# EAGLE board legacy mk1 with acc_16meg_crystal and TPs (EAGLE 9.5.2)
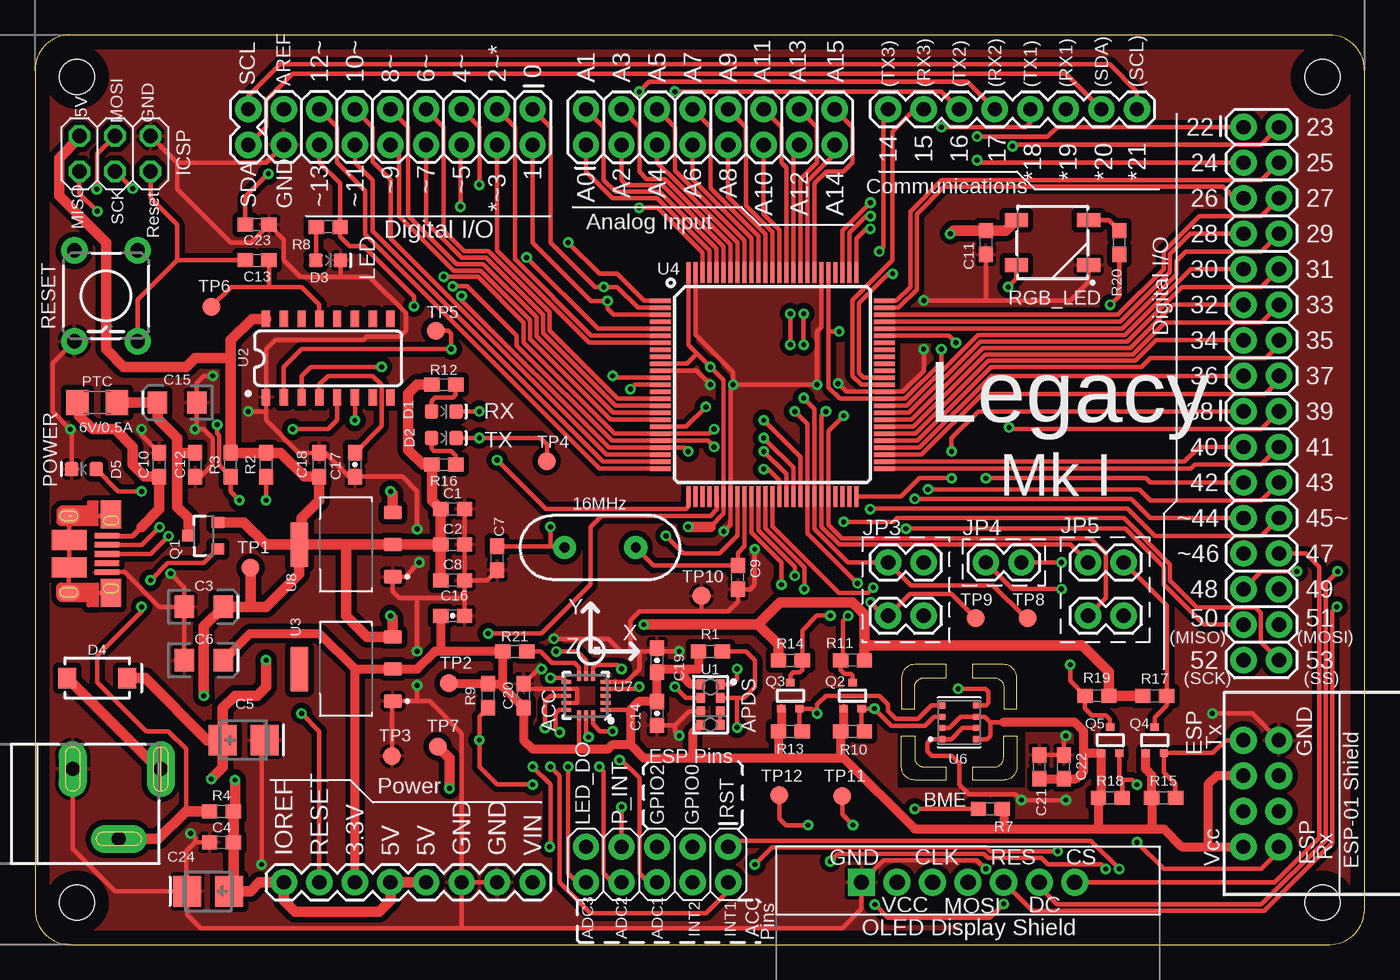
[diagram p2: board, top side]
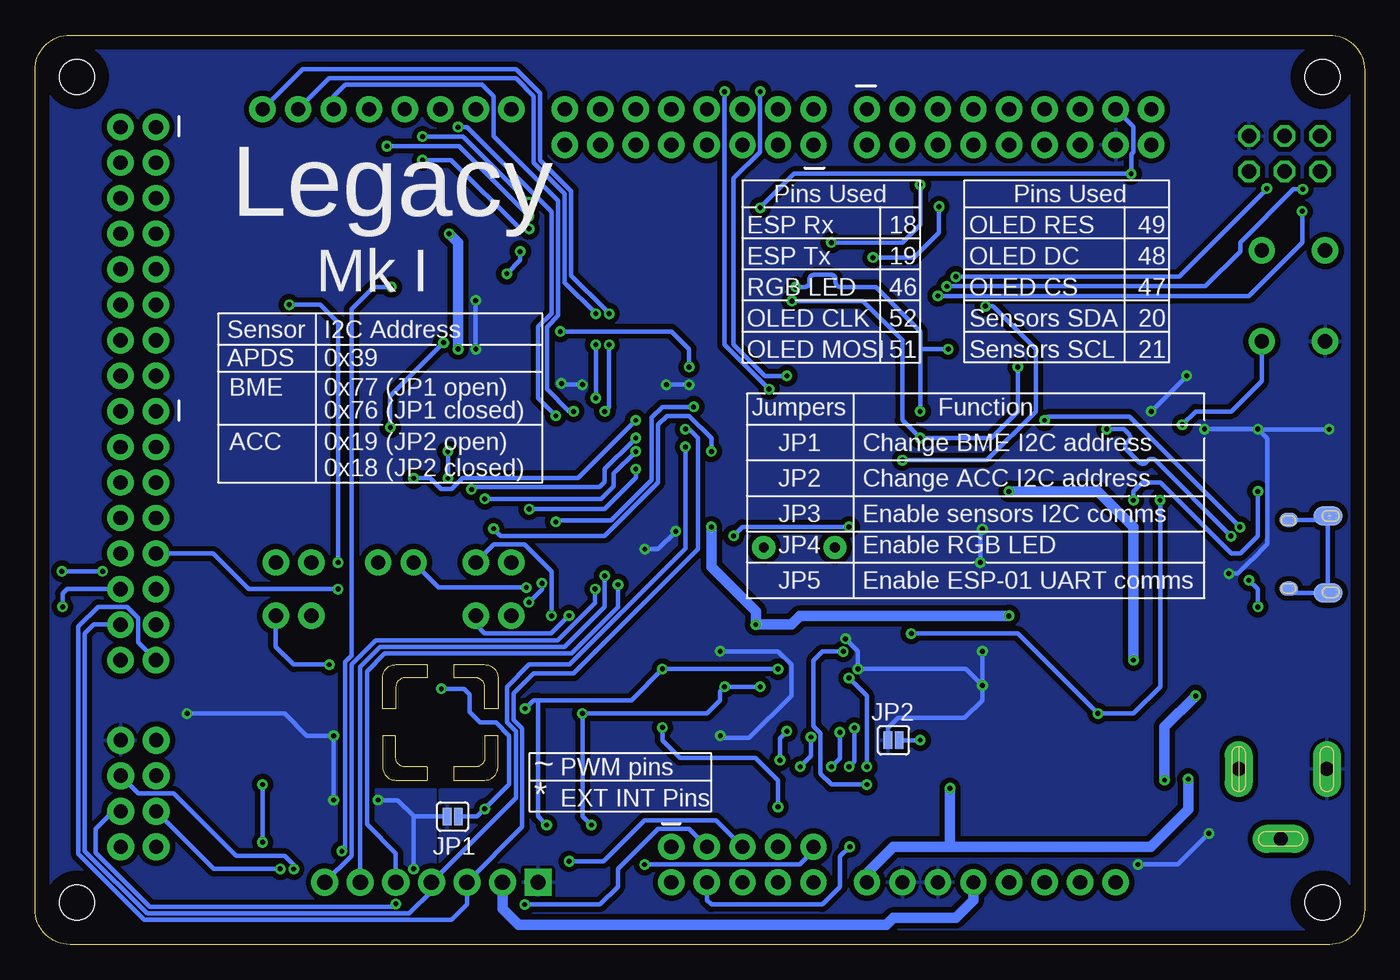
[diagram p3: board, bottom side, seen from below]

Size 95 x 65 mm. Coordinates in mm from the lower left corner, seen from the top.
Outline: 0,62.5 0,2.5 arc90 2.5,0 92.5,0 arc90 95,2.5 95,62.5 arc90 92.5,65 2.5,65 arc90 0,62.5
Copper layers (1*16): Top 0.035mm / dielectric 1.5mm / Bottom 0.035mm
Design rules "default": minimum track width 6mil, minimum drill 0.35mm, track to track 6mil, track to pad 6mil, pad to pad 6mil, via to via 6mil, smd to smd 6mil, copper to edge 40mil, drill to drill 6mil, minimum pad ring 10mil, minimum via ring 8mil, stop-mask expansion 4mil, vias tented up to drill 0mil, thermal gap 10mil
Holes 2.5 mm at 3,3 3,62 92,62 92,3
Milling: 32 lines

## Footprints (pad centres in the part's own frame; a part is rotated, then mirrored left to right if it is on the bottom)
0603 = smd 1.1 x 1: 1 -0.85,0; 2 0.85,0
EIA3216 = smd 1.4 x 1.6: + 1.4,0; - -1.4,0
CT3528 = smd 2 x 2.2: + -1.5,0; - 1.5,0
0603-CAP = smd 1.1 x 1: 1 -0.85,0; 2 0.85,0
LED-0603 = smd 1 x 1: A -0.877,0; C 0.877,0
SMA-DIODE = smd 1.27 x 1.47: A -2.15,0; C 2.15,0
USB-MICROB-PTH-MILL = smd 0.4 x 1.75: D+ 0.031,1.331; D- -0.619,1.331; GND 1.331,1.331; ID 0.681,1.331; VBUS -1.269,1.331 | smd 2 x 1.46: SHIELD -2.794,1.606; SHIELD2 2.831,1.606 | smd 1.425 x 2.5: SHIELD3 -0.979,-1.349; SHIELD4 0.996,-1.352 | smd 1.4 x 2.1 bottom: SHIELD5 -2.7,-1.2; SHIELD7 2.8,-1.2 | smd 1.1 x 1.5: SHIELD6 2.8,-1.4; SHIELD8 -2.7,-1.4 | smd 1 x 1.3 bottom: SHIELD9 -2.4,1.6; SHIELD10 2.5,1.6
2X03 = drill 1.016 octagon: 1 -2.54,-1.27; 2 -2.54,1.27; 3 0,-1.27; 4 0,1.27; 5 2.54,-1.27; 6 2.54,1.27
POWER_JACK_SLOT = drill 1 pad 2 long: GND@1 2.58,7.5; GND@2 7.58,10.8; PWR 2.58,13.8
1X08 = drill 1.016 pad 1.88: 1 0,0; 2 2.54,0; 3 5.08,0; 4 7.62,0; 5 10.16,0; 6 12.7,0; 7 15.24,0; 8 17.78,0
2X8 = drill 1.016 pad 1.88: 1 0,0; 2 0,2.54; 3 2.54,0; 4 2.54,2.54; 5 5.08,0; 6 5.08,2.54; 7 7.62,0; 8 7.62,2.54; 9 10.16,0; 10 10.16,2.54; 11 12.7,0; 12 12.7,2.54; 13 15.24,0; 14 15.24,2.54; 15 17.78,0; 16 17.78,2.54
1X02 = drill 1.016 pad 1.88: 1 0,0; 2 2.54,0
2X5 = drill 1.016 pad 1.88: 1 0,0; 2 0,2.54; 3 2.54,0; 4 2.54,2.54; 5 5.08,0; 6 5.08,2.54; 7 7.62,0; 8 7.62,2.54; 9 10.16,0; 10 10.16,2.54
SMT-JUMPER_2_NO_SILK = smd 0.635 x 1.27: 1 -0.406,0; 2 0.406,0
OLED_SHIELD = drill 1.1 pad 1.93: CS 7.62,0; D0/CLK -2.54,0; D1/MOSI 0,0; DC 5.08,0; RES 2.54,0; VCC -5.08,0 | drill 1.1 pad 1.93 square: GROUND -7.62,0
1206 = smd 1.6 x 1.8: 1 -1.4,0; 2 1.4,0
SOT23-3 = smd 0.8 x 0.9: 1 -0.95,-1; 2 0.95,-1; 3 0,1.1
SOT323-R = smd 0.6 x 0.55: 1 -0.65,-0.925; 2 0.65,-0.925; 3 0,0.925
TACTILE_SWITCH_PTH_6.0MM = drill 1.016 pad 1.88: 1 -3.251,2.261; 2 3.251,2.261; 3 -3.251,-2.261; 4 3.251,-2.261
WS2812B = smd 1.651 x 1: 1 2.577,-1.6; 2 2.577,1.6; 3 -2.577,1.6; 4 -2.577,-1.6
B1,27 = smd 1.27 x 1.27: TP 0,0
APDS-9960 = smd 0.6 x 0.72: 1 0.7,1.455; 2 0.7,0.485; 3 0.7,-0.485; 4 0.7,-1.455; 5 -0.7,-1.455; 6 -0.7,-0.485; 7 -0.7,0.485; 8 -0.7,1.455
SO016 = smd 0.6 x 1.2: 1 -4.445,-2.8; 2 -3.175,-2.8; 3 -1.905,-2.8; 4 -0.635,-2.8; 5 0.635,-2.8; 6 1.905,-2.8; 7 3.175,-2.8; 8 4.445,-2.8; 9 4.445,2.8; 10 3.175,2.8; 11 1.905,2.8; 12 0.635,2.8; 13 -0.635,2.8; 14 -1.905,2.8; 15 -3.175,2.8; 16 -4.445,2.8
SOT229P700X180-4N = smd 0.93 x 1.31: 1 -2.29,-3.345; 2 0,-3.345; 3 2.29,-3.345 | smd 3.24 x 1.31: 4 0,3.345
TQFP100 = smd 1.5 x 0.3: 1 -8,6; 2 -8,5.5; 3 -8,5; 4 -8,4.5; 5 -8,4; 6 -8,3.5; 7 -8,3; 8 -8,2.5; 9 -8,2; 10 -8,1.5; 11 -8,1; 12 -8,0.5; 13 -8,0; 14 -8,-0.5; 15 -8,-1; 16 -8,-1.5; 17 -8,-2; 18 -8,-2.5; 19 -8,-3; 20 -8,-3.5; 21 -8,-4; 22 -8,-4.5; 23 -8,-5; 24 -8,-5.5; 25 -8,-6; 51 8,-6; 52 8,-5.5; 53 8,-5; 54 8,-4.5; 55 8,-4; 56 8,-3.5; 57 8,-3; 58 8,-2.5; 59 8,-2; 60 8,-1.5; 61 8,-1; 62 8,-0.5; 63 8,0; 64 8,0.5; 65 8,1; 66 8,1.5; 67 8,2; 68 8,2.5; 69 8,3; 70 8,3.5; 71 8,4; 72 8,4.5; 73 8,5; 74 8,5.5; 75 8,6 | smd 0.3 x 1.5: 26 -6,-8; 27 -5.5,-8; 28 -5,-8; 29 -4.5,-8; 30 -4,-8; 31 -3.5,-8; 32 -3,-8; 33 -2.5,-8; 34 -2,-8; 35 -1.5,-8; 36 -1,-8; 37 -0.5,-8; 38 0,-8; 39 0.5,-8; 40 1,-8; 41 1.5,-8; 42 2,-8; 43 2.5,-8; 44 3,-8; 45 3.5,-8; 46 4,-8; 47 4.5,-8; 48 5,-8; 49 5.5,-8; 50 6,-8; 76 6,8; 77 5.5,8; 78 5,8; 79 4.5,8; 80 4,8; 81 3.5,8; 82 3,8; 83 2.5,8; 84 2,8; 85 1.5,8; 86 1,8; 87 0.5,8; 88 0,8; 89 -0.5,8; 90 -1,8; 91 -1.5,8; 92 -2,8; 93 -2.5,8; 94 -3,8; 95 -3.5,8; 96 -4,8; 97 -4.5,8; 98 -5,8; 99 -5.5,8; 100 -6,8
ESP8266_ESP-01 = drill 1.016 pad 1.93: 1 -3.81,-11.13; 2 -1.27,-11.13; 3 1.27,-11.13; 4 3.81,-11.13; 5 3.81,-8.59; 6 1.27,-8.59; 7 -1.27,-8.59; 8 -3.81,-8.59
PSON80P300X300X100-8N = smd 0.5 x 0.5: 1 1.2,1.2; 2 1.2,0.4; 3 1.2,-0.4; 4 1.2,-1.2; 5 -1.2,-1.22; 6 -1.2,-0.4; 7 -1.2,0.4; 8 -1.2,1.2
LGA-16-3X3 = smd 0.7 x 0.28: 1 -1.4,1; 2 -1.4,0.5; 3 -1.4,0; 4 -1.4,-0.5; 5 -1.4,-1; 9 1.4,-1; 10 1.4,-0.5; 11 1.4,0; 12 1.4,0.5; 13 1.4,1 | smd 0.28 x 0.7: 6 -0.5,-1.4; 7 0,-1.4; 8 0.5,-1.4; 14 0.5,1.4; 15 0,1.4; 16 -0.5,1.4
HC49US = drill 0.7 pad 1.651: 1 -2.54,0; 2 2.54,0

## Placement (x,y rotation side)
C1  0.1uF  [0603]  29.84,31.11 0 top
C2  0.1uF  [0603]  29.84,28.57 0 top
C3  10uF  [EIA3216]  12.06,24.13 0 top
C4  0.1uF  [0603]  13.34,7.3 180 top
C5  22uF  [CT3528]  14.92,14.61 0 top
C6  10uF  [EIA3216]  12.06,20.32 0 top
C7  22pF  [0603]  33.02,27.61 90 top
C8  0.1uF  [0603]  29.84,26.04 0 top
C9  22pF  [0603]  50.22,26.24 90 top
C10  0.1uF  [0603]  8.89,34.29 90 top
C11  0.1uF  [0603]  67.94,50.16 270 top
C12  0.1uF  [0603]  11.43,34.29 270 top
C13  0.1uF  [0603]  15.88,48.9 180 top
C14  1.0uF  [0603-CAP]  44.45,16.51 270 top
C15  10uF  [EIA3216]  10.16,38.73 180 top
C16  1.0uF  [0603-CAP]  29.84,23.5 0 top
C17  10nF  [0603-CAP]  22.86,34.29 270 top
C18  0.1uF  [0603]  20.32,34.29 90 top
C19  1.0uF  [0603-CAP]  44.45,20.32 90 top
C20  0.1uF  [0603]  34.92,17.78 90 top
C21  0.1uF  [0603]  71.75,12.7 90 top
C22  0.1uF  [0603]  73.5,12.7 90 top
C23  0.1uF  [0603]  15.88,51.44 0 top
C24  22uF  [CT3528]  12.38,3.81 180 top
D1  Yellow  [LED-0603]  29.21,38.1 0 top
D2  GREEN  [LED-0603]  29.21,36.2 0 top
D3  BLUE  [LED-0603]  20.95,48.9 0 top
D4  1A/40V/500mV  [SMA-DIODE]  4.45,19.05 0 top
D5  GREEN  [LED-0603]  3.49,33.97 180 top
J1  AMP FCI 10103594-0001LF  [USB-MICROB-PTH-MILL]  3.81,27.94 270 top
J2  ICSP  [2X03]  5.71,56.52 0 top
J3  POWER_JACKSLT  [POWER_JACK_SLOT]  -4.81,15.12 270 top
J4  [1X08]  78.74,59.69 180 top
J5  [2X8]  86.36,58.42 270 top
J6  [2X8]  39.37,57.15 0 top
J7  [2X8]  86.36,38.1 270 top
J8  [1X02]  63.5,27.3 180 top
J9  [1X02]  63.5,23.5 180 top
J10  [1X08]  17.78,4.45 0 top
J11  [1X02]  77.79,27.3 180 top
J12  [1X02]  77.79,23.5 180 top
J13  [1X02]  67.94,27.3 0 top
J14  [2X5]  49.53,6.99 180 top
J15  [2X8]  35.56,59.69 180 top
J16  [1X02]  15.24,57.15 90 top
JP1  JUMPER-SMT_2_NO_SILK  [SMT-JUMPER_2_NO_SILK]  65.15,9.15 0 bottom
JP2  JUMPER-SMT_2_NO_SILK  [SMT-JUMPER_2_NO_SILK]  33.66,14.61 0 bottom
OLED  OLED_SHIELD  [OLED_SHIELD]  66.67,4.45 0 top
PTC  6V/0.5A  [1206]  4.45,38.73 0 top
Q1  1A/60V/500mΩ  [SOT23-3]  12.06,29.21 90 top
Q2  BSS138W  [SOT323-R]  58.42,17.78 0 top
Q3  BSS138W  [SOT323-R]  53.98,17.78 0 top
Q4  BSS138W  [SOT323-R]  80.01,14.61 0 top
Q5  BSS138W  [SOT323-R]  76.83,14.61 0 top
R1  10k  [0603]  48.26,20.95 180 top
R2  10k  [0603]  16.51,34.29 90 top
R3  10k  [0603]  13.97,34.29 90 top
R4  10k  [0603]  13.34,9.53 0 top
R7  4.7k  [0603]  68.26,9.68 0 top
R8  4.7k  [0603]  20.95,51.28 0 top
R9  10k  [0603]  32.38,17.78 90 top
R10  4.7k  [0603]  58.42,15.24 180 top
R11  4.7k  [0603]  58.42,20.32 0 top
R12  4.7k  [0603]  29.21,40.01 180 top
R13  4.7k  [0603]  53.98,15.24 180 top
R14  4.7k  [0603]  53.98,20.32 180 top
R15  4.7k  [0603]  80.64,10.48 180 top
R16  4.7k  [0603]  29.21,34.29 180 top
R17  4.7k  [0603]  80.01,17.78 180 top
R18  4.7k  [0603]  76.83,10.48 180 top
R19  4.7k  [0603]  75.88,17.78 0 top
R20  220  [0603]  77.47,50.16 90 top
R21  10k  [0603]  34.29,20.95 180 top
RESET  MOMENTARY-SWITCH-SPST-PTH-6.0MM  [TACTILE_SWITCH_PTH_6.0MM]  5.08,46.35 90 top
RGB_LED  WS2812B  [WS2812B]  72.71,50.16 180 top
TP1  PTR1B1,27  [B1,27]  15.4,26.91 0 top
TP2  PTR1B1,27  [B1,27]  29.56,18.67 0 top
TP3  PTR1B1,27  [B1,27]  25.51,13.47 0 top
TP4  PTR1B1,27  [B1,27]  36.56,34.54 0 top
TP5  PTR1B1,27  [B1,27]  28.63,43.87 0 top
TP6  PTR1B1,27  [B1,27]  12.6,45.58 0 top
TP7  PTR1B1,27  [B1,27]  28.78,14.16 0 top
TP8  PTR1B1,27  [B1,27]  70.94,23.34 0 top
TP9  PTR1B1,27  [B1,27]  67.21,23.34 0 top
TP10  PTR1B1,27  [B1,27]  47.62,24.92 0 top
TP11  PTR1B1,27  [B1,27]  57.68,10.59 0 top
TP12  PTR1B1,27  [B1,27]  53.19,10.67 0 top
U1  APDS-9960  [APDS-9960]  48.26,17.14 0 top
U2  CH340C  [SO016]  20.95,41.91 0 top
U3  AMS1117-3.3  [SOT229P700X180-4N]  22.23,19.68 90 top
U4  ATMEGA2560AU  [TQFP100]  52.7,40.01 0 top
U5  ESP8266_ESP-01  [ESP8266_ESP-01]  97.47,10.79 270 top
U6  BME680  [PSON80P300X300X100-8N]  66.04,15.88 180 top
U7  LIS3DH  [LGA-16-3X3]  39.37,17.78 180 top
U8  AMS1117-5.0  [SOT229P700X180-4N]  22.23,28.57 90 top
Y2  16MHz  [HC49US]  40.39,28.37 180 top

## Tracks (layer width: path | path; a pad name or v marks a point on that pad's centre or on a via)
3.3V
  Top 0.305: U7.14 38.87,14.11 38.73,13.97 | U7.1 42.27,16.78 42.55,16.51 | 68.26,15.88 67.86,16.27 U6.6 66.12,16.27 65.32,15.47 U6.2 | 68.26,15.88 68.26,14.92 68.02,14.68 U6.8 | 69.21,15.88 68.27,15.88 68.26,15.88
  Top 0.508: 75.98,8.47 76.2,8.26
  Top 0.635: 29.21,20.95 R21.2 33.44,18.4 | 29.21,20.95 28.57,20.95 27.3,19.68 U3.2 22.86,19.68 | C16.1 29,21.17 29.21,20.95 | R1.2 47.41,19.68 46.41,19.68 | 46.41,19.68 44.66,19.68 C19.1 C14.1 43.14,17.36 42.55,16.76 42.55,16.51 42.55,14.29 | Q3.1 53.33,15.44 R13.2 53.12,13.55 53.34,13.34 | Q2.1 57.77,15.44 R10.2 57.57,13.55 57.78,13.34 | 42.55,14.29 43.5,13.34 46.99,13.34 | 46.99,13.34 53.34,13.34 | U1.5 46.99,15.12 46.99,13.34 | C6.+ 15.37,22.23 20.32,22.23 22.86,19.68 | J10.3 22.86,19.68 | 33.44,18.4 34.23,17.61 34.24,17.61 C20.1 34.92,14.61 35.56,13.97 38.73,13.97 40.96,13.97 41.27,14.29 42.55,14.29 | 33.44,18.4 33.21,18.63 R9.2 32.35,18.67 TP2.TP | 83.82,6.99 81.92,6.99 80.64,8.26 80.01,8.26 | 83.82,6.99 U5.4 | 69.22,8.26 62.87,8.26 57.78,13.34 | 69.22,8.26 76.2,8.26 80.01,8.26 | 53.34,13.34 57.78,13.34 | C21.1 C22.1 74.4,11.85 74.93,12.38 74.93,13.65 | 74.93,13.65 74.93,15.24 74.29,15.88 69.21,15.88 | R7.2 69.22,9.58 69.22,8.26 | U5.2 84.45,12.06 83.82,11.43 83.82,6.99 | 75.98,8.47 R18.2 76.14,10.64 76.14,13.64 Q5.1 76.16,13.65 74.93,13.65 | 80.01,8.26 79.8,8.47 R15.2 79.8,12.1 79.36,12.54 Q4.1 | U1.8 46.86,18.6 46.41,19.05 46.41,19.68
5V  (via drill 0.35)
  Top 0.305: 48.26,29.84 49.2,30.79 U4.31 49.2,40.33 v48.26,41.27 47.31,42.23 | U4.100 46.7,42.83 47.31,42.23 | U4.10 46.59,41.51 47.31,42.23 | U4.80 56.7,43.81 | 56.7,43.81 56.7,39.81 57.52,39.01 U4.61 62.17,39.01 64.77,41.6 v64.77,42.55 | v57.47,43.81 56.7,43.81
  Top 0.762: U8.4 22.23,28.57 | 22.23,28.57 U8.2 C2.1 | C2.1 C1.1 28.36,31.75 R16.2 27.73,34.29 26.67,35.34 26.67,39.37 27.3,40.01 R12.2 | C2.1 C8.1 | U8.4 19.05,28.75 19.05,30.48 20.32,31.75 C18.1 19.27,33.44 17.57,35.14 R2.2 R3.2 13.97,41.91 | Q1.2 14.93,30.16 16.51,28.57 U8.4 | 15.4,24.13 C3.+ 12.06,22.73 v12.06,17.78 | 15.4,24.13 16.52,24.13 18.88,26.49 U8.4 | 22.23,28.57 22.23,23.5 23.75,21.98 U3.3 25.57,23.32 v25.4,23.5 | J10.5 J10.4 25.4,3.17 24.57,2.35 18.61,2.35 17.78,3.17 J10.1 16.03,4.45 15.4,3.81 C24.+ 14.19,4.11 C4.1 R4.2 14.29,9.63 v14.29,11.75 | 13.97,41.91 13.97,43.18 15.5,44.71 U2.16 | J2.2 3.17,57.66 1.71,56.2 1.71,53.53 5.08,50.16 5.08,42.55 6.35,41.27 10.79,41.27 11.43,41.91 13.97,41.91 | R11.2 59.27,21.38 | v43.5,22.86 51.64,22.86 51.67,22.89 | 51.67,22.89 53.23,24.45 58.42,24.45 59.27,23.6 59.27,21.38 | R14.2 53.12,21.43 51.67,22.89 | v65.41,50.8 65.62,51.02 C11.1 69.38,51.02 RGB_LED.1 | 59.27,21.38 74.83,21.38 76.73,19.47 R19.2 R17.2 | 48.26,29.84 v46.67,29.84 | TP1.TP 15.4,24.13
  Bottom 0.305: v48.26,41.27 48.26,42.55 49.53,43.81 v57.47,43.81
  Bottom 0.762: OLED.VCC 61.59,2.54 60.45,1.4 34.16,1.4 33.66,1.91 29.21,1.91 27.94,3.17 J10.5 | v65.41,50.8 64.77,50.16 v64.77,42.55 | v12.06,17.78 14.29,15.56 v14.29,11.75 | v25.4,23.5 40.32,23.5 40.96,22.86 v43.5,22.86 43.5,23.81 46.67,26.99 v46.67,29.84
!DTR
  Top 0.305: U2.13 20.32,45.72 19.05,46.99 16.8,46.99 | TP6.TP 14.01,46.99 16.8,46.99 | 16.8,46.99 16.73,47.07 C13.1
A0
  Top 0.305: U4.97 48.2,49.59 44.45,53.34 41.27,53.34 39.37,55.24 J6.1
A1
  Top 0.305: U4.96 48.7,49.73 44.64,53.8 41.46,53.8 40.64,54.62 40.64,58.42 J6.2
A2
  Top 0.305: U4.95 49.2,49.88 44.83,54.25 42.27,54.25 41.91,54.61 J6.3
A3
  Top 0.305: U4.94 49.7,50.02 45.02,54.71 43.71,54.71 43.18,55.24 43.18,58.42 J6.4
A4
  Top 0.305: J6.5 44.45,55.88 45.16,55.17 45.21,55.17 50.2,50.17 U4.93
A5
  Top 0.305: U4.92 50.7,50.32 45.72,55.3 45.72,58.42 J6.6
A6
  Top 0.305: U4.91 51.2,50.46 46.99,54.68 J6.7
A7
  Top 0.305: U4.90 51.7,50.61 48.26,54.06 48.26,58.42 J6.8
A8
  Top 0.305: U4.89 52.2,50.76 49.53,53.43 J6.9
A9
  Top 0.305: J6.10 50.8,58.42 50.8,52.81 52.7,50.9 U4.88
A10
  Top 0.305: U4.87 53.2,51.05 52.07,52.19 J6.11
A11
  Top 0.305: U4.86 53.7,55.52 53.34,55.88 53.34,58.42 J6.12
A12
  Top 0.305: U4.85 54.2,56.74 J6.13
A13
  Top 0.305: U4.84 54.7,54.7 55.88,55.88 55.88,58.42 J6.14
A14
  Top 0.305: U4.83 55.2,54.56 57.15,56.5 J6.15
A15
  Top 0.305: U4.82 55.7,54.41 56.54,55.24 57.78,55.24 58.42,55.88 58.42,58.42 J6.16
ACC_ADC1  (via drill 0.35)
  Top 0.305: v41.77,13.17 41.9,13.17 43.18,11.9 43.18,5.08 43.81,4.45 J14.6 | U7.16 39.87,15.76 40.39,15.24 v41.27,15.24
  Bottom 0.305: v41.27,15.24 41.77,14.75 v41.77,13.17
ACC_ADC2  (via drill 0.35)
  Top 0.305: v40.32,12.7 40.64,12.38 40.64,5.08 41.27,4.45 J14.8 | U7.15 39.37,15 v39.55,14.82
  Bottom 0.305: v39.55,14.82 39.55,13.47 v40.32,12.7
ACC_ADC3  (via drill 0.35)
  Top 0.305: v38.1,12.7 38.1,5.08 38.73,4.45 J14.10 | v37.49,15.16 37.19,15.47 37.19,16.54 37.43,16.78 U7.13
  Bottom 0.305: v37.49,15.16 37.49,13.31 v38.1,12.7
ACC_INT1  (via drill 0.35)
  Top 0.305: v36.83,12.7 37.47,12.06 37.47,4.45 39.69,2.22 47.94,2.22 49.53,3.81 J14.2 | v36.45,15.47 36.45,17.4 36.83,17.78 U7.11
  Bottom 0.305: v36.45,15.47 36.45,13.08 v36.83,12.7
ACC_INT2  (via drill 0.35)
  Top 0.305: U7.9 37.71,19.04 v36.84,19.04 | v35.56,12.7 36.83,11.43 36.83,7.03 v36.78,6.99
  Bottom 0.305: J14.4 46.99,3.17 46.67,2.86 38.73,2.86 37.47,4.12 37.47,6.29 v36.78,6.99 | v36.84,19.04 35.56,17.77 v35.56,12.7
AREF  (via drill 0.35)
  Top 0.305: C23.1 15.03,53.43 v16.68,55.08 | U4.98 47.7,49.44 44.49,52.66 v43.18,52.66
  Bottom 0.305: J15.15 16.54,58.45 16.54,56.63 16.68,56.49 v16.68,55.08 40.76,55.08 v43.18,52.66
ESP_GPIO0  (via drill 0.35)
  Top 0.305: v69.22,2.9 68.22,1.92 60.95,1.92 v60.01,2.86
  Bottom 0.305: U5.6 89.39,9.53 90.67,8.26 90.67,6.54 86.81,2.68 69.44,2.68 v69.22,2.9 | J14.3 48.26,8.26 50.48,8.26 53.34,5.4 53.34,4.13 54.61,2.86 v60.01,2.86
ESP_GPIO2  (via drill 0.35)
  Top 0.305: v56.83,5.95 57.38,6.49 67.8,6.49 68.09,6.21 71.89,6.21 72.39,5.71 76.19,5.71 v76.51,5.39
  Bottom 0.305: J14.5 46.35,8.89 51.45,8.89 54.39,5.95 v56.83,5.95 | U5.7 87.61,10.79 85.09,10.79 80.64,6.34 77.15,6.34 76.51,5.71 v76.51,5.39
ESP_RST  (via drill 0.35)
  Top 0.305: J14.1 49.95,7.41 75.46,7.41 v77.47,5.4
  Bottom 0.305: U5.3 82.22,5.4 v77.47,5.4
ESP_RX  (via drill 0.35)
  Top 0.305: U5.5 88.88,6.65 87.63,5.4 80.64,5.4 v78.74,7.3 | v78.74,11.43 78.39,11.78 77.71,11.78 | R18.1 77.69,11.75 77.71,11.78 | Q5.2 77.5,13.67 77.5,11.99 77.71,11.78
  Bottom 0.305: v78.74,7.3 v78.74,11.43
ESP_TX
  Top 0.305: U5.1 85.09,14.61 84.17,13.68 Q4.2 80.66,12.3 81.5,11.47 R15.1
GND  (via drill 0.35)
  Top 0.305: RESET.1 1.27,41.55 1.27,38.08 v2.53,36.82 2.62,36.73 D5.C | J1.GND 6.41,26.61 8.89,24.13 C3.- | C6.- C3.- | C10.2 7.62,36.41 v7.62,36.83 | C12.2 11.85,33.44 12.7,34.29 12.7,36.2 12.06,36.83 v11.43,36.83 11.56,36.96 C15.- 11.56,40.13 12.06,40.64 v12.7,40.64 | 16.51,38.1 16.51,37.47 18.84,35.14 C18.2 20.74,35.14 22.44,33.44 C17.2 26.25,33.44 27.3,32.38 v27.3,29.69 | 16.51,38.1 U2.1 16.51,42.55 17.14,43.18 23.44,43.18 23.7,43.43 26.06,43.43 26.52,43.89 26.52,45.11 23.93,47.7 21.87,47.7 | J10.6 J10.7 | J3.GND@1 2.69,6.83 5.71,3.81 C24.- | C3.- 10.66,25.53 v9.69,26.5 | v15.24,38.1 16.51,38.1 | 10.16,55.88 10.16,53.98 13.97,50.16 15.46,50.16 C23.2 17.78,50.38 17.78,48.9 18.97,47.7 21.87,47.7 | 10.16,55.88 J2.6 | J15.16 16.51,55.88 10.16,55.88 | U7.12 38.73,17.28 38.73,18.28 U7.10 35.27,18.28 C20.2 35.98,19.68 v36.2,19.68 | C16.2 30.7,24.77 | 30.7,24.77 C8.2 | 27.3,24.77 26.04,24.77 25.57,25.23 U8.1 26.44,26.29 v27.46,27.3 | 27.3,24.77 30.7,24.77 | 27.3,24.77 v27.3,20.95 | 45.72,15.66 C14.2 | U1.6 46.72,16.66 45.72,15.66 | C1.2 C2.2 C8.2 | U7.5 42.27,18.78 43.18,19.68 43.18,20.95 | 44.34,21.06 44.23,20.95 43.18,20.95 | 44.34,21.06 C19.2 | 42.55,20.95 41.86,20.95 40.97,21.85 v37.08,21.85 | 42.55,20.95 43.18,20.95 | 42.55,20.95 42.55,23.18 43.18,23.81 47.62,23.81 | U4.11 47.26,41.01 v48.26,40.01 | v49.89,40.01 49.7,39.82 U4.32 49.68,31.98 49.68,30 v49.21,29.53 | U4.99 47.2,43.6 49.89,40.92 v49.89,40.01 | 30.48,1.17 57.68,1.17 59.05,2.54 OLED.GROUND 60.64,6.03 67.31,6.03 v67.94,5.4 | J10.6 30.48,1.17 | U4.81 56.2,44.14 55.88,43.81 v55.88,40.01 v49.89,40.01 | v57.39,40.1 57.98,39.51 U4.62 62.02,39.51 63.5,40.98 v63.5,42.55
  Top 0.305: U6.7 66.28,15.47 65.47,14.68 U6.1 64.05,14.68 63.78,14.4 63.78,13.79 64.08,13.49 65.53,13.49 66.06,12.95 66.06,11.41 66.74,10.73 70.07,10.73 v70.48,10.32 v73.66,10.32 | 73.5,13.81 C22.2 | C21.2 73.24,13.55 73.5,13.81 | 47.62,23.81 49.53,23.81 50.22,24.5 C9.1 51.12,25.39 51.43,25.7 v51.43,28.25 | v63.51,46.02 67.94,46.02 | 67.94,46.02 73.98,46.02 75.28,47.33 RGB_LED.3 | U5.8 86.98,16.51 v84.14,16.51 | v73.66,14.92 73.5,14.76 73.5,13.81 | C11.2 67.94,46.02 | C24.- 10.88,2.13 11.85,1.17 30.48,1.17 | C4.2 11.43,7.3 | 11.43,7.3 10.79,6.67 10.79,3.9 C24.- | C5.- 16.19,14.38 v16.19,5.71 | v11.11,7.94 11.43,7.62 11.43,7.3 | v46.04,14.92 45.72,15.24 45.72,15.66 | v46.04,20.95 44.45,20.95 44.34,21.06 | C7.1 32.3,26.04 C8.2 | 27.23,17.39 28.19,17.39 30.48,15.1 J10.6 | 27.23,17.39 U3.1 25.51,17.34 TP3.TP | 27.23,17.39 27.3,17.47 v27.3,18.52 | 47.62,23.81 TP10.TP | D3.C 21.83,47.74 21.87,47.7
  Bottom 0.305: v7.62,36.83 v11.43,36.83 | v7.62,36.83 v7.61,36.82 v2.53,36.82 | v9.69,26.5 9.05,26.5 8.08,27.48 8.07,27.48 6.94,28.61 6.94,36.15 v7.62,36.83 | v12.7,40.64 v15.24,38.1 | v27.3,20.95 v27.3,18.52 | v27.3,29.69 27.46,29.54 v27.46,27.3 | v27.3,18.52 27.3,17.46 28.57,16.19 33.34,16.19 34.06,15.47 JP2.1 | v37.08,21.85 v37.08,21.84 36.2,20.95 v36.2,19.68 28.47,19.68 v27.3,18.52 | v48.26,40.01 v49.89,40.01 | v55.88,40.01 57.3,40.01 v57.39,40.1 | v63.51,46.02 63.51,42.56 v63.5,42.55 | v84.14,16.51 77.17,16.51 75.58,14.92 v73.66,14.92 v73.66,10.32 | v67.94,5.4 67.94,9.18 | JP1.1 67.92,9.15 67.94,9.18 | v16.19,5.71 13.34,5.71 v11.11,7.94 | v46.04,14.92 45.88,14.76 43.97,14.76 40.96,17.78 40.96,20 41.91,20.95 v46.04,20.95 | 67.94,9.18 69.08,10.32 v70.48,10.32 | v49.21,29.53 50.49,28.25 v51.43,28.25
  pour Top (isolate 0.381): 0,65.09 0,0 66.04,0 66.04,11.11 61.59,11.11 61.59,20.32 70.8,20.32 70.8,11.11 66.36,11.11 66.36,0 94.93,0 94.93,65.09
  pour Bottom (isolate 0.381): 0,65.09 0,0 66.04,0 66.04,11.11 61.59,11.11 61.59,20.32 70.8,20.32 70.8,11.11 66.36,11.11 66.36,0 94.93,0 94.93,65.09
INSERT  (via drill 0.35)
  Top 0.305: Q1.1 12.06,27.26 9.48,27.26 v8.26,26.04 | v7.62,24.13 7.62,23.81 4.45,20.64 4.45,18.73 7.94,15.24 9.53,15.24 10.79,13.97 10.79,9.53
  Top 0.762: R4.1 10.79,9.53 8.81,7.54 J3.GND@2
  Bottom 0.305: v8.26,26.04 7.62,25.4 v7.62,24.13
IO0/RX0  (via drill 0.35)
  Top 0.305: U2.2 17.78,41.27 19.05,42.55 29.72,42.55 | 29.72,42.55 v29.74,42.55 | D1.C v31.75,38.1 | U4.2 43.08,45.51 41.59,46.99 v40.64,46.99 40.01,46.99 36.83,50.16 36.83,58.42 J15.1 | TP5.TP 29.51,43.87 29.72,43.66 29.72,42.55
  Bottom 0.305: v40.64,46.99 40.01,46.99 arc-90 39.66,47.33 39.66,47.52 arc90 39.32,47.87 38.13,47.87 arc90 37.79,47.52 37.79,47.33 arc-90 37.45,46.99 34.92,46.99 31.75,43.81 31.75,42.55 | v31.75,38.1 31.75,42.55 | v29.74,42.55 31.75,42.55
IO1/TX0  (via drill 0.35)
  Top 0.305: U2.3 19.05,40.64 19.68,41.27 v24.77,41.27 | D2.C v31.75,36.2 36.12,36.2 36.58,35.74 36.58,34.55 TP4.TP | U4.3 41.35,45.01 40.91,45.45 v40.91,45.99 39.74,45.99 35.56,50.16 J15.2
  Bottom 0.305: v24.77,41.27 24.77,38.1 26.67,36.2 v31.75,36.2 33.02,37.47 33.02,43.18 35.83,45.99 v40.91,45.99
IO2
  Top 0.305: U4.6 39.75,43.51 34.29,48.96 34.29,58.42 J15.3
IO3
  Top 0.305: U4.7 39.6,43.01 33.02,49.59 J15.4
IO4  (via drill 0.35)
  Top 0.305: J15.5 31.75,58.42 v31.75,54.29 | v38.1,50.16 40.32,47.94 41.59,47.94 43.53,46.01 U4.1
  Bottom 0.305: v31.75,54.29 31.75,51.44 33.02,50.16 v38.1,50.16
IO5  (via drill 0.35)
  Top 0.305: U4.5 40.22,44.01 v35.12,49.09 | v30.4,52.73 30.4,57.07 J15.6
  Bottom 0.305: v35.12,49.09 32.19,49.09 30.4,50.88 v30.4,52.73
IO6
  Top 0.305: U4.15 41.63,39.01 36.75,43.88 36.75,45.21 32.41,49.55 30.67,49.55 29.21,51.01 29.21,58.42 J15.7
IO7
  Top 0.305: U4.16 41.48,38.51 36.3,43.69 36.3,45.02 32.22,49.09 30.48,49.09 27.94,51.63 J15.8
IO8
  Top 0.305: U4.17 41.3,38.01 35.84,43.47 35.84,44.83 32.03,48.63 30.12,48.63 26.67,52.08 26.67,58.42 J15.9
IO9
  Top 0.305: U4.18 41.13,37.51 35.38,43.26 35.38,44.64 31.84,48.18 29.93,48.18 26.04,52.07 26.04,56.52 J15.10
IO10
  Top 0.305: U4.23 40.85,35.01 25.4,50.45 25.4,54.67 24.13,55.94 24.13,58.42 J15.11
IO11
  Top 0.305: U4.24 40.59,34.51 24.13,50.96 24.13,54.61 22.86,55.88 J15.12
IO12
  Top 0.305: U4.25 40.33,34.01 23.58,50.75 23.58,53.89 21.59,55.88 21.59,58.42 J15.13
IO13  (via drill 0.35)
  Top 0.305: J15.14 20.32,55.88 21.8,54.4 R8.2 21.8,50.59 22.48,49.91 23.47,49.91 27.08,46.3 v27.08,45.62 | U4.26 46.7,31.3 46.52,31.11 36.52,31.11 v33.02,34.62
  Bottom 0.305: v27.08,45.62 26.57,45.62 23.5,42.55 23.5,38.1 26.98,34.62 v33.02,34.62
IO14/TX3  (via drill 0.35)
  Top 0.305: U4.64 59.2,40.51 58.88,40.83 58.88,45.85 60.97,47.94 v61.28,47.94 | v60.33,49.53 60.64,49.85 60.64,59.37 J4.8
  Bottom 0.305: v61.28,47.94 60.33,48.9 v60.33,49.53
IO15/RX3
  Top 0.305: U4.63 59.05,40.01 58.42,40.64 58.42,46.04 61.28,48.9 61.28,58.1 62.87,59.69 J4.7
IO16/TX2  (via drill 0.35)
  Top 0.305: J4.6 64.77,60.96 v45.72,60.96 | v42.55,39.69 42.86,40.01 U4.13
  Bottom 0.305: v45.72,60.96 45.72,42.86 v42.55,39.69
IO17/RX2  (via drill 0.35)
  Top 0.305: J4.5 66.63,61.64 43.86,61.64 v43.18,60.96 | U4.12 41.41,40.51 v41.27,40.64
  Bottom 0.305: v43.18,60.96 43.2,60.94 43.2,56.63 45.09,54.76 45.09,42.88 42.85,40.64 v41.27,40.64
IO18/TX1  (via drill 0.35)
  Top 0.305: v57.78,37.78 56.7,36.7 U4.46 56.7,30 57.67,29.03 75.42,29.03 76.52,27.94 76.52,24.77 J12.2 | v64.77,58.42 70.8,58.42 71.12,58.74 J4.4
  Bottom 0.305: v57.78,37.78 59.05,39.05 59.05,44.14 58.1,45.1 58.1,52.39 64.14,58.42 v64.77,58.42
IO19/RX1  (via drill 0.35)
  Top 0.305: v56.52,38.1 56.2,37.79 U4.45 56.2,29.85 57.48,28.57 73.98,28.57 J11.2
  Bottom 0.305: v56.52,38.1 56.83,38.1 58.42,39.69 58.42,44.13 57.61,44.95 57.61,53.16 62.23,57.78 62.23,60.64 63.04,61.45 72.85,61.45 73.66,60.64 J4.3
IO20/SDA  (via drill 0.35)
  Top 0.305: J4.2 73.66,62.23 18.41,62.23 16.51,60.33 16.51,58.42 J16.1 | v54.93,39.05 55.7,38.27 U4.44 55.7,29.7 58.1,27.3 J8.2 62.59,25.67 68.45,25.67 70.79,23.34 TP8.TP | v54.93,42.86 v54.93,45.09
  Bottom 0.305: v54.93,39.05 v54.93,42.86 | v54.93,45.09 57.15,47.31 57.15,53.66 59.37,55.88 59.37,60.64 60.64,61.91 73.98,61.91 J4.2
IO21/SCL  (via drill 0.35)
  Top 0.305: J4.1 78.74,60.96 76.79,62.91 17.51,62.91 15.24,60.64 J16.2 | v59.71,24.45 60.66,23.5 J9.2 62.51,25.05 65.5,25.05 TP9.TP | v58.78,25.82 55.2,29.39 U4.43 55.2,37.19 v54.29,38.1 | v53.98,42.86 v53.98,45.09
  Bottom 0.305: v59.71,24.45 58.78,25.38 v58.78,25.82 | v54.29,38.1 53.98,38.42 v53.98,42.86 | v53.98,45.09 54.24,45.35 54.24,45.37 56.69,47.82 56.69,53.85 58.91,56.07 58.91,60.83 60.63,62.55 75.88,62.55 J4.1
IO22  (via drill 0.35)
  Top 0.305: U4.78 57.7,51.02 v59.7,53.02 | J5.1 73.04,58.42 72.35,57.74 v67.31,57.74
  Bottom 0.305: v67.31,57.74 64.42,57.74 v59.7,53.02
IO23  (via drill 0.35)
  Top 0.305: U4.77 58.2,50.88 59.38,52.06 v59.7,52.06 | J5.2 87.63,57.15 69.95,57.15 v69.85,57.05
  Bottom 0.305: v69.85,57.05 64.7,57.05 v59.7,52.06
IO24  (via drill 0.35)
  Top 0.305: U4.76 58.7,50.45 59.4,51.15 v59.69,51.15 | J5.3 67.48,55.88 v67.31,56.05
  Bottom 0.305: v59.69,51.15 60.35,51.15 65.26,56.05 v67.31,56.05
IO25
  Top 0.305: U4.75 61.56,46.01 62.55,46.99 62.55,52.39 64.77,54.61 87.63,54.61 J5.4
IO26
  Top 0.305: U4.74 61.71,45.51 63.01,46.8 63.01,52.2 64.96,54.15 84.9,54.15 85.71,53.34 J5.5
IO27
  Top 0.305: U4.73 77.39,45.01 80.64,48.26 80.64,49.53 83.19,52.07 87.63,52.07 J5.6
IO28
  Top 0.305: U4.72 77.54,44.51 81.1,48.07 81.1,49.34 82.56,50.8 J5.7
IO29
  Top 0.305: U4.71 77.68,44.01 81.56,47.88 81.56,48.86 82.23,49.53 87.63,49.53 J5.8
IO30
  Top 0.305: U4.60 62.32,38.51 67.36,43.55 77.87,43.55 82.58,48.26 J5.9
IO31
  Top 0.305: U4.59 62.46,38.01 67.55,43.09 78.06,43.09 81.96,46.99 87.63,46.99 J5.10
IO32
  Top 0.305: U4.58 62.61,37.51 67.74,42.63 78.25,42.63 81.34,45.72 J5.11
IO33
  Top 0.305: U4.57 62.76,37.01 67.93,42.18 78.44,42.18 80.71,44.45 87.63,44.45 J5.12
IO34
  Top 0.305: U4.56 62.9,36.51 68.12,41.72 78.63,41.72 80.09,43.18 J5.13
IO35
  Top 0.305: U4.55 63.05,36.01 68.31,41.26 79.04,41.26 79.69,41.91 87.95,41.91 88.9,42.86 J5.14
IO36
  Top 0.305: J5.15 68.33,40.64 63.2,35.51 U4.54
IO37
  Top 0.305: J5.16 88.9,40.32 87.92,39.34 67.68,39.34 63.34,35.01 U4.53
IO38  (via drill 0.35)
  Top 0.305: U4.50 61.87,32.01 63.18,33.32 v65.5,33.32 | J7.1 67.4,38.1 65.5,36.19 v65.5,35.24
  Bottom 0.305: v65.5,33.32 v65.5,33.33 v65.5,35.24
IO39  (via drill 0.35)
  Top 0.305: U4.70 65.31,43.51 v65.81,43.01 | v69.61,36.95 69.73,36.83 87.63,36.83 J7.2
  Bottom 0.305: v65.81,43.01 69.61,39.21 v69.61,36.95
IO40
  Top 0.305: U4.52 82.13,34.51 83.19,35.56 J7.3
IO41
  Top 0.305: U4.51 82.58,34.01 82.87,34.29 87.63,34.29 J7.4
IO42  (via drill 0.35)
  Top 0.305: U4.42 54.7,34.83 v52.07,37.47 | v67.94,33.32 79.39,33.32 79.69,33.02 J7.5
  Bottom 0.305: v67.94,33.32 66.78,33.32 66,32.54 65.25,32.54 64.45,33.34 56.2,33.34 v52.07,37.47
IO43  (via drill 0.35)
  Top 0.305: v52.07,36.2 52.34,35.92 52.35,35.92 54.2,34.07 U4.41 | v63.82,32.53 78.91,32.53 79.69,31.75 87.63,31.75 J7.6
  Bottom 0.305: v52.07,36.2 52.34,35.92 52.35,35.92 54.29,33.99 54.29,33.07 54.65,32.71 63.64,32.71 v63.82,32.53
IO44  (via drill 0.35)
  Top 0.305: U4.40 53.7,33.61 v52.07,35.24 | v62.87,31.85 78.33,31.85 79.69,30.48 J7.7
  Bottom 0.305: v52.07,35.24 53.66,33.66 53.66,32.74 54.55,31.85 v62.87,31.85
IO45  (via drill 0.35)
  Top 0.305: U4.39 53.2,33.16 52.39,33.97 v52.07,33.97 | J7.8 87.63,29.21 80.01,29.21 78.06,31.16 59.74,31.16 v59.69,31.11
  Bottom 0.305: v52.07,33.97 52.07,33.36 54.32,31.11 v59.69,31.11
IO46  (via drill 0.35)
  Top 0.305: U4.38 52.7,29.88 57.45,25.13 59.52,25.13 v59.9,25.51 | J13.1 69.85,25.4 v73.34,25.4
  Bottom 0.305: v73.34,25.4 79.74,25.4 82.28,27.94 J7.9 | v59.9,25.51 66.15,25.51 J13.1
IO47  (via drill 0.35)
  Top 0.305: J7.10 90.81,27.94 91.76,26.99 91.76,7.62 88.58,4.45 OLED.CS | U4.37 52.2,29.73 54.98,26.96 v54.98,25.4
  Bottom 0.305: v54.98,25.4 54.98,24.4 57.65,21.73 70.66,21.73 72.39,20 72.39,6.35 OLED.CS
IO48  (via drill 0.35)
  Top 0.305: J7.11 87.63,26.67 v90.17,26.67 | v93.08,26.67 92.22,25.81 92.22,7.43 87.64,2.86 73.03,2.86 71.75,4.13 OLED.DC | v54.29,26.35 54.29,27 51.7,29.59 U4.36
  Bottom 0.305: v90.17,26.67 v93.08,26.67 | OLED.DC 71.75,19.84 70.33,21.27 57.15,21.27 54.29,24.13 v54.29,26.35
IO49  (via drill 0.35)
  Top 0.305: U4.35 51.2,29.44 53.34,27.3 v53.34,25.72 | OLED.RES 71.26,2.4 87.83,2.4 92.71,7.28 92.71,23.81 v93.03,24.13
  Bottom 0.305: J7.12 92.71,25.4 93.03,25.08 v93.03,24.13 | v53.34,25.72 53.34,24.13 56.67,20.8 70.01,20.8 71.28,19.53 71.28,8.57 69.22,6.51 OLED.RES
IO50/MISO  (via drill 0.35)
  Top 0.305: v30.48,46.35 30.48,46.03 41.01,35.51 U4.22 46.41,35.51 v46.67,35.24 | v4.46,52.4 3.17,53.68 J2.1 | v62.23,29.71 77.92,29.71 80.64,26.99 80.64,25.72 83.5,22.86 J7.13
  Bottom 0.305: v4.46,52.4 4.46,50.16 8.26,46.35 v30.48,46.35 | v46.67,35.24 46.67,36.2 48.26,37.78 49.85,37.78 50.48,37.15 50.48,33.02 54.29,29.21 61.73,29.21 v62.23,29.71
IO51/MOSI  (via drill 0.35)
  Top 0.305: v29.84,47.04 30.89,47.04 34.4,43.53 34.4,42.82 41.22,36.01 U4.21 48.08,36.01 v48.52,35.56 | v4.41,53.98 4.45,54.01 4.45,56.52 J2.4
  Bottom 0.305: v29.84,47.04 11.38,47.04 8.89,49.53 8.89,50.16 5.08,53.98 v4.41,53.98 | J7.14 90.81,22.86 91.44,22.23 91.44,6.67 87,2.22 68.26,2.22 66.67,3.81 OLED.D1/MOSI 60.64,10.48 60.64,15.24 61.28,15.88 61.28,18.41 59.69,20 56.82,20 48.52,28.3 v48.52,35.56
IO52/SCK  (via drill 0.35)
  Top 0.305: v29.21,47.72 31.65,47.72 34.92,44.45 34.92,43 41.42,36.51 U4.20 48.2,36.51 v48.52,36.83 | v6.99,54.02 5.76,55.24 J2.3
  Bottom 0.305: v29.21,47.72 13.24,47.72 6.99,53.98 v6.99,54.02 | J7.15 87.63,21.59 87.63,23.35 88.41,24.13 90.49,24.13 91.9,22.72 91.9,6.48 87.18,1.76 65.23,1.76 64.14,2.86 OLED.D0/CLK 60.19,8.39 60.19,15.43 60.8,16.05 60.8,17.94 59.37,19.37 56.52,19.37 47.62,28.26 47.62,36.2 48.26,36.83 v48.52,36.83
IO53/SS  (via drill 0.35)
  Top 0.305: U4.19 46.52,37.01 v47.94,38.42 | J7.16 87.61,21.61 87.61,23.69 87.19,24.11 83.03,24.11 81.1,26.04 81.1,27.18 77.8,30.48 61.59,30.48 61.33,30.21 v57.78,30.21
  Bottom 0.305: v47.94,38.42 50.17,38.42 50.94,37.65 50.94,33.21 53.85,30.3 57.69,30.3 v57.78,30.21
LED_DO  (via drill 0.35)
  Top 0.305: v73.07,6.67 68.28,6.67 67.99,6.95 52.67,6.95 v51.44,5.71 | RGB_LED.2 70.13,47.59 v69.53,46.99
  Bottom 0.305: v73.07,6.67 72.85,6.89 72.85,20.19 72.39,20.65 72.39,45.4 70.8,46.99 v69.53,46.99 | v51.44,5.71 40.32,5.71 39.37,6.67 J14.9
N$1  (via drill 0.35)
  Top 0.305: U4.33 50.2,29.24 48.91,27.94 46.35,27.94 v45.09,29.21 | C7.2 36.83,28.46 | 36.83,28.46 37.76,28.46 Y2.2 | v36.83,29.84 36.83,28.46
  Bottom 0.305: v45.09,29.21 44.45,29.84 v36.83,29.84
N$2  (via drill 0.35)
  Top 0.305: D5.A 5.96,32.38 v7.62,32.38 | v16.51,31.75 R2.1
  Bottom 0.305: v7.62,32.38 7.62,29.21 8.89,27.94 9.53,27.94 14.61,33.02 15.88,33.02 16.51,32.38 v16.51,31.75
N$3
  Top 0.305: U4.34 50.7,28.48 50.22,27.99 C9.2 44.21,27.09 Y2.1
N$4  (via drill 0.35)
  Top 0.305: R7.1 v62.87,9.68 | U6.5 67.97,17.09 68.14,17.27 68.14,18.05 67.91,18.28 v65.96,18.28
  Bottom 0.305: JP1.2 63.4,9.15 v62.87,9.68 61.12,11.43 61.12,14.92 62.07,15.88 63.18,15.88 63.94,16.63 63.94,17.89 64.33,18.28 v65.96,18.28
N$5
  Top 0.305: R16.1 30.06,34.94 29.72,35.28 28.5,35.28 28.33,35.45 D2.A
N$6
  Top 0.305: U2.4 20.32,40.01 20.95,40.64 24.13,40.64 24.77,40.01 24.77,37.05 C17.1
N$7
  Top 0.305: U1.4 U1.3
N$8
  Top 0.305: D3.A 20.08,51.26 R8.1
N$9
  Top 0.305: D1.A 28.33,38.85 28.57,39.09 29.87,39.09 30.06,39.28 R12.1
N$10  (via drill 0.35)
  Top 0.305: R9.1 31.75,16.3 v31.75,14.61 31.75,12.7 33.02,11.43 v35.56,11.43 | U7.7 39.37,20.3 38.72,20.94 v37.24,20.94
  Bottom 0.305: v31.75,14.61 JP2.2 | v35.56,11.43 38.1,11.43 38.87,12.2 38.87,15.1 39.37,15.6 39.37,20.3 38.72,20.94 v37.24,20.94
N$11  (via drill 0.35)
  Top 0.305: v73.34,27.3 J13.2 | R20.1 77.47,46.35 v76.83,45.72
  Bottom 0.305: v73.34,27.3 73.34,44.45 74.61,45.72 v76.83,45.72
N$12  (via drill 0.35)
  Top 0.305: v58.09,23.48 57.72,23.12 57.72,20.47 R11.1 57.57,19.62 57.84,19.36 58.29,19.36 58.42,19.23 Q2.3
  Bottom 0.305: J8.1 62.23,28.57 60.01,28.57 58.09,26.66 v58.09,23.48
N$13  (via drill 0.35)
  Top 0.305: v8.9,29.84 7.62,28.56 J1.D- | v22.86,37.47 U2.6
  Bottom 0.305: v8.9,29.84 16.8,37.74 22.59,37.74 v22.86,37.47
N$14  (via drill 0.35)
  Top 0.305: v9.54,29.19 8.26,27.91 J1.D+ | v18.41,36.83 20.95,36.83 21.59,37.47 U2.5
  Bottom 0.305: v9.54,29.19 14.96,34.61 arc-90 15.45,34.61 15.61,34.46 arc90 16.09,34.46 17,35.37 arc90 17,35.85 16.84,36.01 arc-90 16.84,36.49 17.18,36.83 v18.41,36.83
N$17
  Top 0.305: J11.1 80.86,24.23 R17.1 80.86,17.08 80.01,16.23 Q4.3
N$18  (via drill 0.35)
  Top 0.305: v56.84,23.5 55.89,23.5 54.83,22.44 R14.1 54.83,19.62 54.63,19.43 54.18,19.43 53.98,19.23 Q3.3
  Bottom 0.305: v56.84,23.5 58.12,22.23 62.87,22.23 63.5,22.86 J9.1
N$19
  Top 0.305: U7.8 38.87,19.8 38.56,20.12 36.96,20.12 36.12,20.95 R21.1
N$20
  Top 0.305: R20.2 76.72,51.77 RGB_LED.4
N$21  (via drill 0.35)
  Top 0.305: v73.98,20 73.98,18.84 R19.1 75.03,16.86 75.51,16.38 76.5,16.38 76.81,16.08 76.81,15.55 Q5.3
  Bottom 0.305: v73.98,20 76.52,20 77.79,21.27 J12.1
PROX_INT  (via drill 0.35)
  Top 0.305: R1.1 50.8,20.95 51.44,20.32 51.44,18.41 50.65,17.63 50.16,17.63 | 50.16,17.63 U1.2 | J14.7 v41.91,9.83 | v50.16,15.51 50.16,17.63
  Bottom 0.305: v41.91,9.83 41.91,11.73 43.51,13.34 48.9,13.34 50.16,14.61 v50.16,15.51
PWRIN
  Top 0.762: D4.A 8.8,12.54 J3.PWR
RESET  (via drill 0.35)
  Top 0.305: v19.05,16.51 20.32,15.24 J10.2 | v14.61,31.75 13.97,32.38 R3.1 13.16,34.25 13.16,36.38 13.02,36.52 v13.02,37.15 | J2.5 8.26,53.34 10.16,51.44 10.16,48.9 | RESET.3 7.34,46.08 10.16,48.9 | 10.16,48.9 C13.2 | v32.38,22.23 36.2,22.23 39.69,25.72 39.69,29.84 40.48,30.64 48.27,30.64 48.75,31.11 48.75,31.96 U4.30
  Bottom 0.305: v13.02,37.15 12.06,38.1 9.53,38.1 7.34,40.28 RESET.3 | v32.38,22.23 24.77,22.23 v19.05,16.51 16.51,16.51 14.61,18.41 v14.61,31.75
SCL_SEN  (via drill 0.35)
  Top 0.305: R13.1 54.62,15.44 Q3.2 55.53,16.86 v55.88,16.51 55.88,17.14 56.52,17.78 60.33,17.78 60.96,17.14 60.96,16.69 61.53,16.12 63.11,16.12 64.06,17.07 U6.4 | U7.4 43.05,18.28 v43.18,18.41 | v45.72,18.41 46.51,17.63 U1.7 | v55.24,8.53 53.65,8.53 53.19,8.99 TP12.TP
  Bottom 0.305: v43.18,18.41 v45.72,18.41 46.04,18.1 46.04,17.46 46.99,16.51 v55.88,16.51 55.88,9.17 v55.24,8.53
SDA_SEN  (via drill 0.35)
  Top 0.305: R10.1 59.07,15.44 Q2.2 v59.98,16.86 61.2,15.63 63.58,15.63 64.22,16.27 U6.3 | U1.1 49.08,18.6 49.09,18.59 49.76,18.59 50.16,19 v50.16,19.68 | U7.6 39.87,19.75 40.08,19.96 41.63,19.96 v41.91,19.68 | v58.45,8.53 57.68,9.3 TP11.TP
  Bottom 0.305: v41.91,19.68 v50.16,19.68 52.39,17.46 59.05,17.46 | v59.98,16.86 59.37,17.46 59.05,17.46 | 59.05,17.46 59.05,9.14 v58.45,8.53
SHLD  (1 unrouted)
  Top 0.305: J1.SHIELD 5.32,30.64 J1.SHIELD8 2.46,30.59 J1.SHIELD3 J1.SHIELD4 2.41,26.9 J1.SHIELD6 5.38,25.14 J1.SHIELD2
  Bottom 0.305: J1.SHIELD9 2.91,30.34 J1.SHIELD5 J1.SHIELD7 5.11,25.14 J1.SHIELD10
USBVCC
  Top 0.762: PTC.2 C15.+ 8.76,37.59 10.16,36.2 10.16,34.92 | Q1.3 10.96,30.48 10.16,31.29 10.16,34.92 | C12.1 10.38,35.14 10.16,34.92
VIN  (via drill 0.35)
  Top 0.762: v25.4,32.38 25.57,32.22 U8.3 | C5.+ 13.42,16.91 14.29,17.78 15.88,17.78 16.51,18.41 v16.51,20.32 | D4.C 7.86,19.05 12.31,14.61 C5.+ | v12.6,11.82 13.42,12.64 C5.+ | TP7.TP 29.62,13.32 v29.62,11.16
  Bottom 0.762: v16.51,20.32 16.51,29.84 19.05,32.38 v25.4,32.38 | J10.8 35.56,5.08 33.66,6.99 29.61,6.99 | v12.6,11.82 12.6,9.65 15.26,6.99 29.61,6.99 | 29.61,6.99 v29.61,11.15 v29.62,11.16
VUSB
  Top 0.356: J1.VBUS 6.99,29.21 7.62,29.84
  Top 0.762: PTC.1 3.17,38.6 3.17,37.78 4.13,36.83 5.71,36.83 6.99,35.56 6.99,34.29 7.83,33.44 C10.1 8.89,31.11 7.62,29.84

## Text on the board
tPlace: MOSI | GND | 12~ | 10~ | 8~ | 6~ | 4~ | 2~* | 0 | A1 | A3 | A5 | A7 | A9 | A11 | A13 | A15 | 5V | SCL | AREF | (TX3) | (RX3) | (TX2) | (RX2) | (TX1) | (RX1) | (SDA) | (SCL) | 22 | 23 | 14 | 15 | 16 | 17 | 1 | *18 | *19 | *20 | *21 | 24 | 25 | ~9 | ~7 | ~5 | Communications | SDA | GND | ~13 | ~11 | A0 | A2 | A4 | A6 | A8 | 26 | 27 | *~3 | A10 | A12 | A14 | MISO | SCK | Analog Input | Reset | Digital I/O | 28 | 29 | 30 | 31 | LED | 32 | 33 | Digital I/O | 34 | 35 | 36 | 37 | RX | TX | Legacy | 38 | 39 | 40 | 41 | POWER | Mk I | 42 | 43 | ~44 | 45~ | JP3 | JP4 | JP5 | ~46 | 47 | 48 | 49 | Y | 50 | 51 | X | (MISO) | (MOSI) | Z | . | 52 | 53 | APDS | (SCK) | (SS) | ACC | ESP Pins | ESP | Tx | GND | Power | BME | LED_DO | P_INT | GPIO2 | GPIO0 | RST | GND | IOREF | RESET | 3.3V | 5V | 5V | GND | GND | VIN | CLK | RES | CS | Vcc | ESP | Rx | ESP-01 Shield | VCC | MOSI | DC | INT2 | INT1 | ACC | OLED Display Shield | ADC3 | ADC2 | ADC1 | Pins
bPlace: Pins Used | Pins Used | Legacy | 49 | OLED RES | 18 | ESP Rx | 48 | OLED DC | 19 | ESP Tx | Mk I | 47 | OLED CS | 46 | RGB LED | 20 | Sensors SDA | 52 | OLED CLK | I2C Address | Sensor | 21 | Sensors SCL | 51 | OLED MOSI | 0x39 | APDS | 0x77 (JP1 open) | BME | Function | Jumpers | 0x76 (JP1 closed) | Change BME I2C address | JP1 | 0x19 (JP2 open) | ACC | Change ACC I2C address | JP2 | 0x18 (JP2 closed) | Enable sensors I2C comms | JP3 | Enable RGB LED | JP4 | Enable ESP-01 UART comms | JP5 | PWM pins | ~ | EXT INT Pins | *